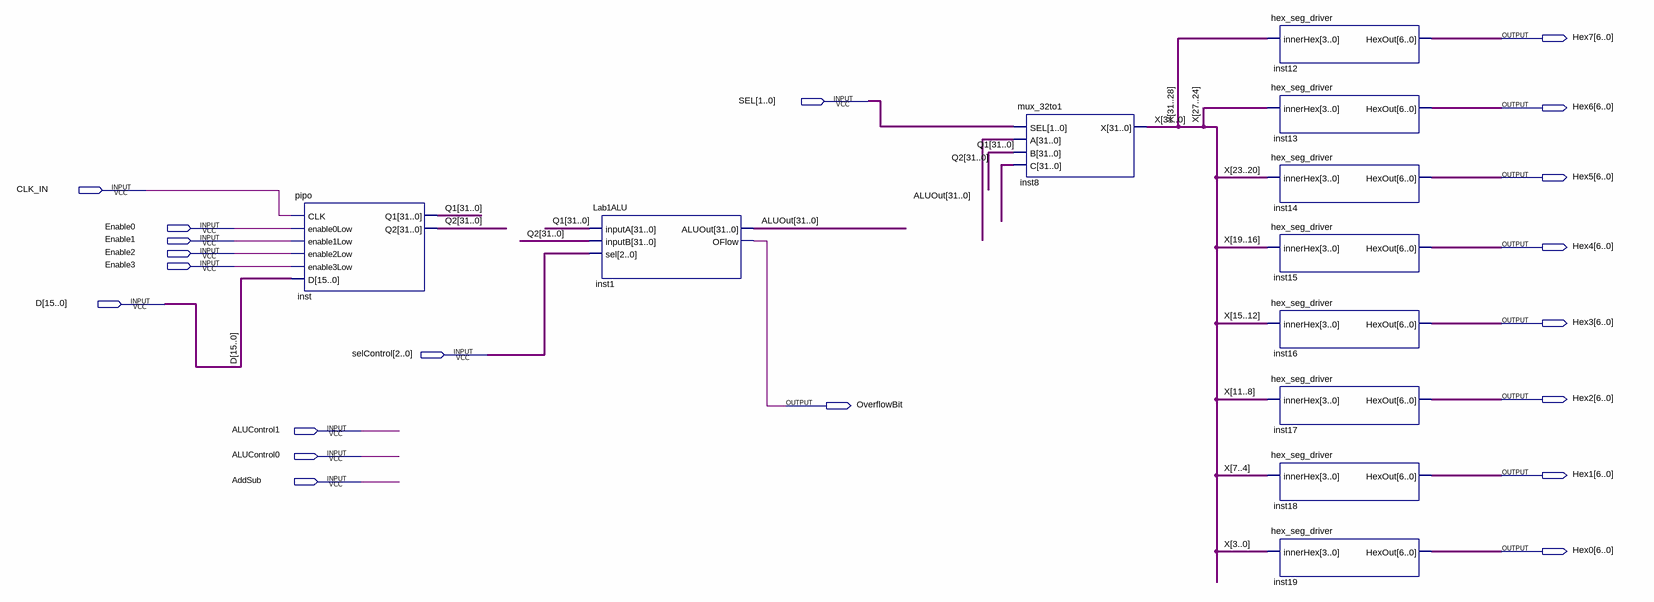
[diagram p0: schematic sheet]
// Quartus schematic Lab3Year3.bdf as structural Verilog: 11 symbols, 20 pins
module Lab3Year3 (
  input  [1:0] SEL,
  input  CLK_IN,
  input  Enable0,
  input  Enable1,
  input  Enable2,
  input  Enable3,
  input  [15:0] D,
  input  [2:0] selControl,
  input  ALUControl1,
  input  ALUControl0,
  input  AddSub,
  output [6:0] Hex7,
  output [6:0] Hex6,
  output [6:0] Hex5,
  output [6:0] Hex4,
  output [6:0] Hex3,
  output [6:0] Hex2,
  output OverflowBit,
  output [6:0] Hex1,
  output [6:0] Hex0
);

  wire [31:0] ALUOut, Q1, Q2, X;

  pipo inst (
    .CLK(CLK_IN), .enable0Low(Enable0), .enable1Low(Enable1), .enable2Low(Enable2), .enable3Low(Enable3),
    .D(D), .Q1(Q1), .Q2(Q2));
  Lab1ALU inst1 (.inputA(Q1), .inputB(Q2), .sel(selControl), .ALUOut(ALUOut), .OFlow(OverflowBit));
  mux_32to1 inst8 (.SEL(SEL), .A(ALUOut), .B(Q1), .C(Q2), .X(X));
  hex_seg_driver inst12 (.innerHex(X[31:28]), .HexOut(Hex7));
  hex_seg_driver inst13 (.innerHex(X[27:24]), .HexOut(Hex6));
  hex_seg_driver inst14 (.innerHex(X[23:20]), .HexOut(Hex5));
  hex_seg_driver inst15 (.innerHex(X[19:16]), .HexOut(Hex4));
  hex_seg_driver inst16 (.innerHex(X[15:12]), .HexOut(Hex3));
  hex_seg_driver inst17 (.innerHex(X[11:8]), .HexOut(Hex2));
  hex_seg_driver inst18 (.innerHex(X[7:4]), .HexOut(Hex1));
  hex_seg_driver inst19 (.innerHex(X[3:0]), .HexOut(Hex0));
endmodule
